# Altium schematic sheet currentandvoltagemeasure.SchDoc
size 297 x 209 mm
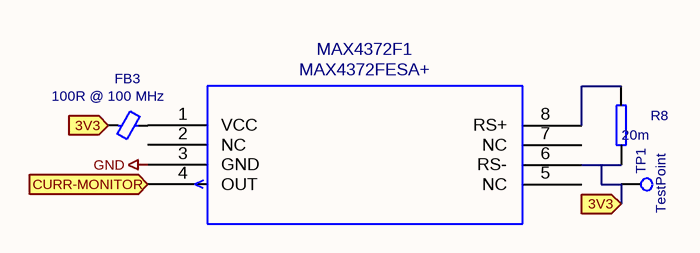
[diagram p0: currentandvoltagemeasure.SchDoc]

## Parts
FB3  100R @ 100 MHz  [INDUC1607X60N]
MAX4372F1  MAX4372FESA+  [SOIC127P600X175-8N]
R8  20m  [RESC1607X60N]
TP1  TestPoint  [TestPoint_Pad_D2.0mm]

## Ports
3V3 (in), CURR-MONITOR (in)

## Nets
GND: MAX4372F1.3(GND)
3V3: FB3.2 MAX4372F1.6(RS-) R8.2 TP1.1 ; port 3V3
CURR-MONITOR: MAX4372F1.4(OUT) ; port CURR-MONITOR
NetFB3_1: FB3.1 MAX4372F1.1(VCC)
NetMAX4372F1_8: MAX4372F1.8(RS+) R8.1

Not connected (* = marked no-connect by the designer): MAX4372F1 2(NC) 5(NC) 7(NC)

## Notes on the sheet
- 1
- 2
- 3
- 4
- 5
- 6
- A
- B
- C
- D
- Title:
- File: currentandvoltagemeasure.kicad_sch
- Sheet: /
- KiCad E.D.A.  kicad (5.1.4)-1
- Size: A4
- Date:
- Rev:
- Id: 1/1

## Library data of the parts
FB3 = Ferrite_Bead_Small: Value: 100R @ 100 MHz; Footprint: STM32_Breakout:INDUC1607X60N
MAX4372F1 = MAX4372FESA+-MAX4372FESA+: Value: MAX4372FESA+; Footprint: STM32_Breakout:SOIC127P600X175-8N
R8 = R0603-OBC_Libary: Value: 20m
TP1 = TestPoint: Value: TestPoint; Footprint: TestPoint:TestPoint_Pad_D2.0mm